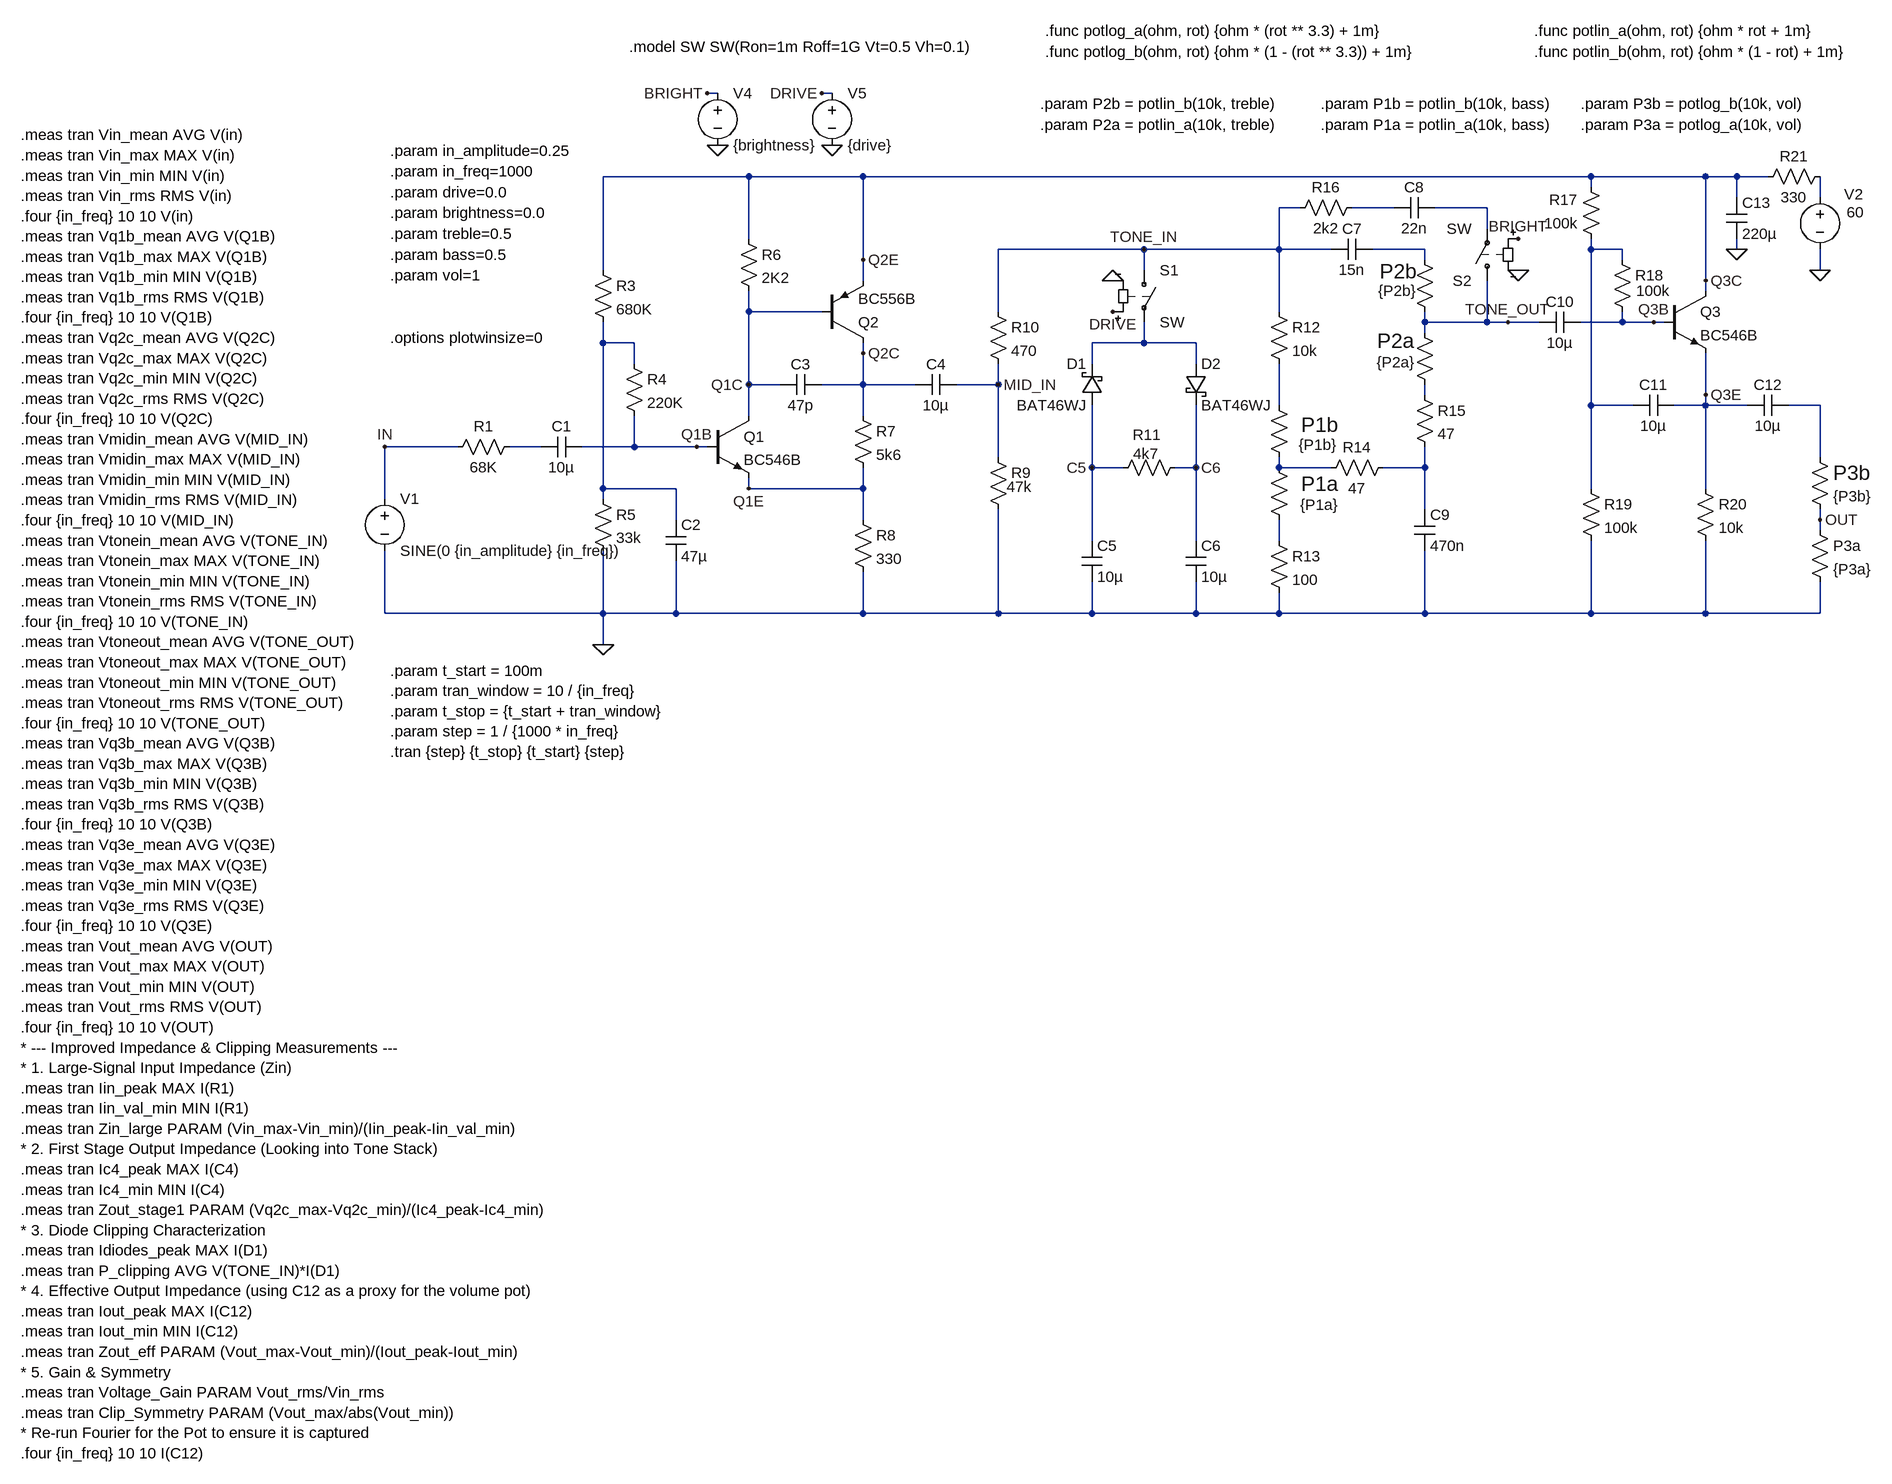
[diagram p0: schematic red_circuits_design.asc]
red_circuits_design.asc, the LTspice schematic file:
Version 4
SHEET 1 2228 1228
WIRE -208 -304 -224 -304
WIRE -32 -304 -48 -304
WIRE -160 -176 -384 -176
WIRE 16 -176 -160 -176
WIRE 1136 -176 16 -176
WIRE 1312 -176 1136 -176
WIRE 1360 -176 1312 -176
WIRE 1408 -176 1360 -176
WIRE 1136 -160 1136 -176
WIRE 1360 -144 1360 -176
WIRE 1488 -144 1488 -176
WIRE 688 -128 656 -128
WIRE 832 -128 768 -128
WIRE 976 -128 896 -128
WIRE 976 -96 976 -128
WIRE -160 -80 -160 -176
WIRE 448 -64 224 -64
WIRE 656 -64 656 -128
WIRE 656 -64 448 -64
WIRE 736 -64 656 -64
WIRE 880 -64 800 -64
WIRE 1136 -64 1136 -80
WIRE 1184 -64 1136 -64
WIRE 1360 -64 1360 -80
WIRE 16 -48 16 -176
WIRE 880 -48 880 -64
WIRE 1184 -48 1184 -64
WIRE -384 -32 -384 -176
WIRE 448 -32 448 -64
WIRE 1488 -32 1488 -64
WIRE 16 -16 16 -48
WIRE 1312 -16 1312 -176
WIRE 1312 0 1312 -16
WIRE -160 32 -160 0
WIRE -48 32 -160 32
WIRE 224 32 224 -64
WIRE 656 32 656 -64
WIRE 880 48 880 32
WIRE 976 48 976 -16
WIRE 976 48 880 48
WIRE 1008 48 976 48
WIRE 1056 48 1008 48
WIRE 1184 48 1184 32
WIRE 1184 48 1120 48
WIRE 1232 48 1184 48
WIRE 1248 48 1232 48
WIRE 880 64 880 48
WIRE -384 80 -384 48
WIRE -336 80 -384 80
WIRE 448 80 448 48
WIRE 448 80 368 80
WIRE 528 80 448 80
WIRE 16 96 16 80
WIRE -336 112 -336 80
WIRE 368 112 368 80
WIRE 528 112 528 80
WIRE -160 144 -160 32
WIRE -112 144 -160 144
WIRE 16 144 16 96
WIRE 16 144 -48 144
WIRE 96 144 16 144
WIRE 224 144 224 112
WIRE 224 144 160 144
WIRE 880 160 880 144
WIRE 1312 160 1312 96
WIRE 656 176 656 112
WIRE 1136 176 1136 -64
WIRE 1200 176 1136 176
WIRE 1312 176 1312 160
WIRE 1312 176 1264 176
WIRE 1376 176 1312 176
WIRE 1488 176 1440 176
WIRE -160 192 -160 144
WIRE 16 192 16 144
WIRE -608 240 -720 240
WIRE -480 240 -528 240
WIRE -336 240 -336 192
WIRE -336 240 -416 240
WIRE -240 240 -336 240
WIRE -224 240 -240 240
WIRE 224 256 224 144
WIRE 1488 256 1488 176
WIRE 368 272 368 176
WIRE 416 272 368 272
WIRE 528 272 528 176
WIRE 528 272 496 272
WIRE 656 272 656 256
WIRE 736 272 656 272
WIRE 880 272 880 240
WIRE 880 272 816 272
WIRE -384 304 -384 80
WIRE -272 304 -384 304
WIRE -160 304 -160 288
WIRE 16 304 16 272
WIRE 16 304 -160 304
WIRE 1136 304 1136 176
WIRE 1312 304 1312 176
WIRE -720 320 -720 240
WIRE -384 320 -384 304
WIRE 880 336 880 272
WIRE -272 352 -272 304
WIRE 16 352 16 304
WIRE 1488 352 1488 336
WIRE 1488 368 1488 352
WIRE 368 384 368 272
WIRE 528 384 528 272
WIRE 656 384 656 352
WIRE -720 496 -720 400
WIRE -384 496 -384 400
WIRE -384 496 -720 496
WIRE -272 496 -272 416
WIRE -272 496 -384 496
WIRE 16 496 16 432
WIRE 16 496 -272 496
WIRE 224 496 224 336
WIRE 224 496 16 496
WIRE 368 496 368 448
WIRE 368 496 224 496
WIRE 528 496 528 448
WIRE 528 496 368 496
WIRE 656 496 656 464
WIRE 656 496 528 496
WIRE 880 496 880 400
WIRE 880 496 656 496
WIRE 1136 496 1136 384
WIRE 1136 496 880 496
WIRE 1312 496 1312 384
WIRE 1312 496 1136 496
WIRE 1488 496 1488 448
WIRE 1488 496 1312 496
WIRE -384 544 -384 496
FLAG 1488 -32 0
FLAG -240 240 Q1B
FLAG -160 144 Q1C
FLAG -160 304 Q1E
FLAG 16 96 Q2C
FLAG 16 -48 Q2E
FLAG 1232 48 Q3B
FLAG 1312 -16 Q3C
FLAG 1312 160 Q3E
FLAG 1488 352 OUT
FLAG -384 544 0
FLAG 224 144 MID_IN
FLAG 368 272 C5
FLAG 528 272 C6
FLAG -720 240 IN
FLAG 1360 -64 0
FLAG 400 -16 0
FLAG 400 32 DRIVE
FLAG -208 -224 0
FLAG -32 -224 0
FLAG -224 -304 BRIGHT
FLAG -48 -304 DRIVE
FLAG 1008 48 TONE_OUT
FLAG 1024 -32 0
FLAG 1024 -80 BRIGHT
FLAG 448 -64 TONE_IN
DATAFLAG -384 80 "round($*100)/100"
DATAFLAG -336 240 "round($*100)/100"
DATAFLAG 16 144 "round($*100)/100"
DATAFLAG -160 32 "round($*100)/100"
DATAFLAG 1136 -32 "round($*100)/100"
DATAFLAG 1184 48 "round($*100)/100"
DATAFLAG 1312 176 "round($*100)/100"
DATAFLAG -80 304 "round($*100)/100"
DATAFLAG 176 144 "round($*100)/100"
DATAFLAG 528 -176 "round($*100)/100"
SYMBOL npn -224 192 R0
SYMATTR InstName Q1
SYMATTR Value BC546B
SYMBOL npn 1248 0 R0
SYMATTR InstName Q3
SYMATTR Value BC546B
SYMBOL Cap -48 128 R90
WINDOW 0 0 32 VBottom 2
WINDOW 3 32 32 VTop 2
SYMATTR InstName C3
SYMATTR Value 47p
SYMBOL Cap 160 128 R90
WINDOW 0 0 32 VBottom 2
WINDOW 3 32 32 VTop 2
SYMATTR InstName C4
SYMATTR Value 10µ
SYMBOL Res 0 176 R0
SYMATTR InstName R7
SYMATTR Value 5k6
SYMBOL Res -400 -48 R0
SYMATTR InstName R3
SYMATTR Value 680K
SYMBOL Res -176 -96 R0
SYMATTR InstName R6
SYMATTR Value 2K2
SYMBOL Res 208 16 R0
SYMATTR InstName R10
SYMATTR Value 470
SYMBOL Res 0 336 R0
SYMATTR InstName R8
SYMATTR Value 330
SYMBOL Res 640 160 R0
WINDOW 0 50 46 Left 3
WINDOW 3 46 77 Left 2
SYMATTR InstName P1b
SYMATTR Value {P1b}
SYMBOL Res 640 256 R0
WINDOW 0 50 41 Left 3
WINDOW 3 48 73 Left 2
SYMATTR InstName P1a
SYMATTR Value {P1a}
SYMBOL Res 832 256 R90
WINDOW 0 0 56 VBottom 2
WINDOW 3 32 56 VTop 2
SYMATTR InstName R14
SYMATTR Value 47
SYMBOL Cap 800 -80 R90
WINDOW 0 0 32 VBottom 2
WINDOW 3 32 32 VTop 2
SYMATTR InstName C7
SYMATTR Value 15n
SYMBOL Res 864 -64 R0
WINDOW 3 -56 64 Left 2
WINDOW 0 -53 34 Left 3
SYMATTR Value {P2b}
SYMATTR InstName P2b
SYMBOL Res 864 48 R0
WINDOW 3 -58 62 Left 2
WINDOW 0 -57 29 Left 3
SYMATTR Value {P2a}
SYMATTR InstName P2a
SYMBOL Cap 864 336 R0
SYMATTR InstName C9
SYMATTR Value 470n
SYMBOL Cap 1120 32 R90
WINDOW 0 0 32 VBottom 2
WINDOW 3 32 32 VTop 2
SYMATTR InstName C10
SYMATTR Value 10µ
SYMBOL Res 1152 -64 R180
WINDOW 0 36 76 Left 2
WINDOW 3 36 40 Left 2
SYMATTR InstName R17
SYMATTR Value 100k
SYMBOL Res 1296 288 R0
SYMATTR InstName R20
SYMATTR Value 10k
SYMBOL Res -400 304 R0
SYMATTR InstName R5
SYMATTR Value 33k
SYMBOL Res 1120 288 R0
SYMATTR InstName R19
SYMATTR Value 100k
SYMBOL voltage 1488 -160 R0
WINDOW 0 37 11 Left 2
WINDOW 3 41 39 Left 2
SYMATTR InstName V2
SYMATTR Value 60
SYMBOL pnp -48 80 M180
SYMATTR InstName Q2
SYMATTR Value BC556B
SYMBOL Cap 352 384 R0
SYMATTR InstName C5
SYMATTR Value 10µ
SYMBOL Cap 512 384 R0
SYMATTR InstName C6
SYMATTR Value 10µ
SYMBOL Res 512 256 R90
WINDOW 0 -19 59 VBottom 2
WINDOW 3 -21 61 VTop 2
SYMATTR InstName R11
SYMATTR Value 4k7
SYMBOL Res 1472 352 R0
SYMATTR InstName P3a
SYMATTR Value {P3a}
SYMBOL Res 1472 240 R0
WINDOW 0 36 40 Left 3
SYMATTR InstName P3b
SYMATTR Value {P3b}
SYMBOL Cap -288 352 R0
SYMATTR InstName C2
SYMATTR Value 47µ
SYMBOL Res -352 96 R0
SYMATTR InstName R4
SYMATTR Value 220K
SYMBOL Res 640 16 R0
SYMATTR InstName R12
SYMATTR Value 10k
SYMBOL Res 640 368 R0
SYMATTR InstName R13
SYMATTR Value 100
SYMBOL Res 864 144 R0
SYMATTR InstName R15
SYMATTR Value 47
SYMBOL Res 1168 -64 R0
WINDOW 3 37 64 Left 2
SYMATTR Value 100k
SYMATTR InstName R18
SYMBOL Cap 1264 160 R90
WINDOW 0 0 32 VBottom 2
WINDOW 3 32 32 VTop 2
SYMATTR InstName C11
SYMATTR Value 10µ
SYMBOL Cap 1440 160 R90
WINDOW 0 0 32 VBottom 2
WINDOW 3 32 32 VTop 2
SYMATTR InstName C12
SYMATTR Value 10µ
SYMBOL Res 208 240 R0
WINDOW 3 29 61 Left 2
SYMATTR Value 47k
SYMATTR InstName R9
SYMBOL schottky 384 176 R180
WINDOW 0 24 64 Left 2
WINDOW 3 24 0 Left 2
SYMATTR InstName D1
SYMATTR Value BAT46WJ
SYMATTR Description Diode
SYMATTR Type diode
SYMBOL schottky 512 112 R0
SYMATTR InstName D2
SYMATTR Value BAT46WJ
SYMATTR Description Diode
SYMATTR Type diode
SYMBOL Res -512 224 R90
WINDOW 0 0 56 VBottom 2
WINDOW 3 32 56 VTop 2
SYMATTR InstName R1
SYMATTR Value 68K
SYMBOL Cap -416 224 R90
WINDOW 0 0 32 VBottom 2
WINDOW 3 32 32 VTop 2
SYMATTR InstName C1
SYMATTR Value 10µ
SYMBOL Res 784 -144 R90
WINDOW 0 0 56 VBottom 2
WINDOW 3 32 56 VTop 2
SYMATTR InstName R16
SYMATTR Value 2k2
SYMBOL Res 1504 -192 R90
WINDOW 0 0 56 VBottom 2
WINDOW 3 32 56 VTop 2
SYMATTR InstName R21
SYMATTR Value 330
SYMBOL Cap 1344 -144 R0
SYMATTR InstName C13
SYMATTR Value 220µ
SYMBOL sw 448 -48 R0
SYMATTR InstName S1
SYMBOL sw 976 0 R180
SYMATTR InstName S2
SYMBOL Voltage -208 -320 R0
SYMATTR InstName V4
SYMATTR Value {brightness}
SYMBOL Voltage -32 -320 R0
SYMATTR InstName V5
SYMATTR Value {drive}
SYMBOL Cap 896 -144 R90
WINDOW 0 0 32 VBottom 2
WINDOW 3 32 32 VTop 2
SYMATTR InstName C8
SYMATTR Value 22n
SYMBOL Voltage -720 304 R0
SYMATTR InstName V1
SYMATTR Value SINE(0 {in_amplitude} {in_freq})
TEXT -712 -88 Left 2 !.param treble=0.5
TEXT -712 -152 Left 2 !.param drive=0.0
TEXT 296 -400 Left 2 !.func potlog_a(ohm, rot) {ohm * (rot ** 3.3) + 1m}
TEXT 288 -288 Left 2 !.param P2b = potlin_b(10k, treble)
TEXT 288 -256 Left 2 !.param P2a = potlin_a(10k, treble)
TEXT 720 -288 Left 2 !.param P1b = potlin_b(10k, bass)
TEXT 720 -256 Left 2 !.param P1a = potlin_a(10k, bass)
TEXT -712 -56 Left 2 !.param bass=0.5
TEXT 1120 -288 Left 2 !.param P3b = potlog_b(10k, vol)
TEXT 1120 -256 Left 2 !.param P3a = potlog_a(10k, vol)
TEXT -712 -24 Left 2 !.param vol=1
TEXT 296 -368 Left 2 !.func potlog_b(ohm, rot) {ohm * (1 - (rot ** 3.3)) + 1m}
TEXT 1048 -400 Left 2 !.func potlin_a(ohm, rot) {ohm * rot + 1m}
TEXT 1048 -368 Left 2 !.func potlin_b(ohm, rot) {ohm * (1 - rot) + 1m}
TEXT -344 -376 Left 2 !.model SW SW(Ron=1m Roff=1G Vt=0.5 Vh=0.1)
TEXT -712 -120 Left 2 !.param brightness=0.0
TEXT -712 -216 Left 2 !.param in_amplitude=0.25
TEXT -712 -184 Left 2 !.param in_freq=1000
TEXT -712 72 Left 2 !.options plotwinsize=0
TEXT -712 584 Left 2 !.param t_start = 100m\n.param tran_window = 10 / {in_freq}\n.param t_stop = {t_start + tran_window}\n.param step = 1 / {1000 * in_freq}\n.tran {step} {t_stop} {t_start} {step}
TEXT -1280 -240 Left 2 !.meas tran Vin_mean AVG V(in)\n.meas tran Vin_max MAX V(in)\n.meas tran Vin_min MIN V(in)\n.meas tran Vin_rms RMS V(in)\n.four {in_freq} 10 10 V(in)\n.meas tran Vq1b_mean AVG V(Q1B)\n.meas tran Vq1b_max MAX V(Q1B)\n.meas tran Vq1b_min MIN V(Q1B)\n.meas tran Vq1b_rms RMS V(Q1B)\n.four {in_freq} 10 10 V(Q1B)\n.meas tran Vq2c_mean AVG V(Q2C)\n.meas tran Vq2c_max MAX V(Q2C)\n.meas tran Vq2c_min MIN V(Q2C)\n.meas tran Vq2c_rms RMS V(Q2C)\n.four {in_freq} 10 10 V(Q2C)\n.meas tran Vmidin_mean AVG V(MID_IN)\n.meas tran Vmidin_max MAX V(MID_IN)\n.meas tran Vmidin_min MIN V(MID_IN)\n.meas tran Vmidin_rms RMS V(MID_IN)\n.four {in_freq} 10 10 V(MID_IN)\n.meas tran Vtonein_mean AVG V(TONE_IN)\n.meas tran Vtonein_max MAX V(TONE_IN)\n.meas tran Vtonein_min MIN V(TONE_IN)\n.meas tran Vtonein_rms RMS V(TONE_IN)\n.four {in_freq} 10 10 V(TONE_IN)\n.meas tran Vtoneout_mean AVG V(TONE_OUT)\n.meas tran Vtoneout_max MAX V(TONE_OUT)\n.meas tran Vtoneout_min MIN V(TONE_OUT)\n.meas tran Vtoneout_rms RMS V(TONE_OUT)\n.four {in_freq} 10 10 V(TONE_OUT)\n.meas tran Vq3b_mean AVG V(Q3B)\n.meas tran Vq3b_max MAX V(Q3B)\n.meas tran Vq3b_min MIN V(Q3B)\n.meas tran Vq3b_rms RMS V(Q3B)\n.four {in_freq} 10 10 V(Q3B)\n.meas tran Vq3e_mean AVG V(Q3E)\n.meas tran Vq3e_max MAX V(Q3E)\n.meas tran Vq3e_min MIN V(Q3E)\n.meas tran Vq3e_rms RMS V(Q3E)\n.four {in_freq} 10 10 V(Q3E)\n.meas tran Vout_mean AVG V(OUT)\n.meas tran Vout_max MAX V(OUT)\n.meas tran Vout_min MIN V(OUT)\n.meas tran Vout_rms RMS V(OUT)\n.four {in_freq} 10 10 V(OUT)\n* --- Improved Impedance & Clipping Measurements ---\n* 1. Large-Signal Input Impedance (Zin)\n.meas tran Iin_peak MAX I(R1)\n.meas tran Iin_val_min MIN I(R1)\n.meas tran Zin_large PARAM (Vin_max-Vin_min)/(Iin_peak-Iin_val_min)\n* 2. First Stage Output Impedance (Looking into Tone Stack)\n.meas tran Ic4_peak MAX I(C4)\n.meas tran Ic4_min MIN I(C4)\n.meas tran Zout_stage1 PARAM (Vq2c_max-Vq2c_min)/(Ic4_peak-Ic4_min)\n* 3. Diode Clipping Characterization\n.meas tran Idiodes_peak MAX I(D1)\n.meas tran P_clipping AVG V(TONE_IN)*I(D1)\n* 4. Effective Output Impedance (using C12 as a proxy for the volume pot)\n.meas tran Iout_peak MAX I(C12)\n.meas tran Iout_min MIN I(C12)\n.meas tran Zout_eff PARAM (Vout_max-Vout_min)/(Iout_peak-Iout_min)\n* 5. Gain & Symmetry\n.meas tran Voltage_Gain PARAM Vout_rms/Vin_rms\n.meas tran Clip_Symmetry PARAM (Vout_max/abs(Vout_min))\n* Re-run Fourier for the Pot to ensure it is captured\n.four {in_freq} 10 10 I(C12)

The netlist it stands for:
* red_circuits_design.asc
Q1 Q1C Q1B Q1E 0 BC546B
Q3 Q3C Q3B Q3E 0 BC546B
C3 Q2C Q1C 47p
C4 MID_IN Q2C 10µ
R7 Q2C Q1E 5k6
R3 Q3C N006 680K
R6 Q3C Q1C 2K2
R10 TONE_IN MID_IN 470
R8 Q1E 0 330
R§P1b N009 N012 {P1b}
R§P1a N012 N014 {P1a}
R14 N013 N012 47
C7 N004 TONE_IN 15n
R§P2b N004 TONE_OUT {P2b}
R§P2a TONE_OUT N008 {P2a}
C9 N013 0 470n
C10 Q3B TONE_OUT 10µ
R17 N005 Q3C 100k
R20 Q3E 0 10k
R5 N006 0 33k
R19 N005 0 100k
V2 N001 0 60
Q2 Q2C Q1C Q3C 0 BC556B
C5 C5 0 10µ
C6 C6 0 10µ
R11 C6 C5 4k7
R§P3a OUT 0 {P3a}
R§P3b N010 OUT {P3b}
C2 N006 0 47µ
R4 N006 Q1B 220K
R12 TONE_IN N009 10k
R13 N014 0 100
R15 N008 N013 47
R18 N005 Q3B 100k
C11 Q3E N005 10µ
C12 N010 Q3E 10µ
R9 MID_IN 0 47k
D1 C5 N007 BAT46WJ
D2 N007 C6 BAT46WJ
R1 N011 IN 68K
C1 Q1B N011 10µ
R16 N002 TONE_IN 2k2
R21 N001 Q3C 330
C13 Q3C 0 220µ
S1 TONE_IN N007 DRIVE 0 SW
S2 TONE_OUT N003 BRIGHT 0 SW
V4 BRIGHT 0 {brightness}
V5 DRIVE 0 {drive}
C8 N003 N002 22n
V1 IN 0 SINE(0 {in_amplitude} {in_freq})
.model D D
.lib standard.dio
.model NPN NPN
.model PNP PNP
.lib standard.bjt
.param treble=0.5
.param drive=0.0
.func potlog_a(ohm, rot) {ohm * (rot ** 3.3) + 1m}
.param P2b = potlin_b(10k, treble)
.param P2a = potlin_a(10k, treble)
.param P1b = potlin_b(10k, bass)
.param P1a = potlin_a(10k, bass)
.param bass=0.5
.param P3b = potlog_b(10k, vol)
.param P3a = potlog_a(10k, vol)
.param vol=1
.func potlog_b(ohm, rot) {ohm * (1 - (rot ** 3.3)) + 1m}
.func potlin_a(ohm, rot) {ohm * rot + 1m}
.func potlin_b(ohm, rot) {ohm * (1 - rot) + 1m}
.model SW SW(Ron=1m Roff=1G Vt=0.5 Vh=0.1)
.param brightness=0.0
.param in_amplitude=0.25
.param in_freq=1000
.options plotwinsize=0
.param t_start = 100m
.param tran_window = 10 / {in_freq}
.param t_stop = {t_start + tran_window}
.param step = 1 / {1000 * in_freq}
.tran {step} {t_stop} {t_start} {step}
.meas tran Vin_mean AVG V(in)
.meas tran Vin_max MAX V(in)
.meas tran Vin_min MIN V(in)
.meas tran Vin_rms RMS V(in)
.four {in_freq} 10 10 V(in)
.meas tran Vq1b_mean AVG V(Q1B)
.meas tran Vq1b_max MAX V(Q1B)
.meas tran Vq1b_min MIN V(Q1B)
.meas tran Vq1b_rms RMS V(Q1B)
.four {in_freq} 10 10 V(Q1B)
.meas tran Vq2c_mean AVG V(Q2C)
.meas tran Vq2c_max MAX V(Q2C)
.meas tran Vq2c_min MIN V(Q2C)
.meas tran Vq2c_rms RMS V(Q2C)
.four {in_freq} 10 10 V(Q2C)
.meas tran Vmidin_mean AVG V(MID_IN)
.meas tran Vmidin_max MAX V(MID_IN)
.meas tran Vmidin_min MIN V(MID_IN)
.meas tran Vmidin_rms RMS V(MID_IN)
.four {in_freq} 10 10 V(MID_IN)
.meas tran Vtonein_mean AVG V(TONE_IN)
.meas tran Vtonein_max MAX V(TONE_IN)
.meas tran Vtonein_min MIN V(TONE_IN)
.meas tran Vtonein_rms RMS V(TONE_IN)
.four {in_freq} 10 10 V(TONE_IN)
.meas tran Vtoneout_mean AVG V(TONE_OUT)
.meas tran Vtoneout_max MAX V(TONE_OUT)
.meas tran Vtoneout_min MIN V(TONE_OUT)
.meas tran Vtoneout_rms RMS V(TONE_OUT)
.four {in_freq} 10 10 V(TONE_OUT)
.meas tran Vq3b_mean AVG V(Q3B)
.meas tran Vq3b_max MAX V(Q3B)
.meas tran Vq3b_min MIN V(Q3B)
.meas tran Vq3b_rms RMS V(Q3B)
.four {in_freq} 10 10 V(Q3B)
.meas tran Vq3e_mean AVG V(Q3E)
.meas tran Vq3e_max MAX V(Q3E)
.meas tran Vq3e_min MIN V(Q3E)
.meas tran Vq3e_rms RMS V(Q3E)
.four {in_freq} 10 10 V(Q3E)
.meas tran Vout_mean AVG V(OUT)
.meas tran Vout_max MAX V(OUT)
.meas tran Vout_min MIN V(OUT)
.meas tran Vout_rms RMS V(OUT)
.four {in_freq} 10 10 V(OUT)
* --- Improved Impedance & Clipping Measurements ---
* 1. Large-Signal Input Impedance (Zin)
.meas tran Iin_peak MAX I(R1)
.meas tran Iin_val_min MIN I(R1)
.meas tran Zin_large PARAM (Vin_max-Vin_min)/(Iin_peak-Iin_val_min)
* 2. First Stage Output Impedance (Looking into Tone Stack)
.meas tran Ic4_peak MAX I(C4)
.meas tran Ic4_min MIN I(C4)
.meas tran Zout_stage1 PARAM (Vq2c_max-Vq2c_min)/(Ic4_peak-Ic4_min)
* 3. Diode Clipping Characterization
.meas tran Idiodes_peak MAX I(D1)
.meas tran P_clipping AVG V(TONE_IN)*I(D1)
* 4. Effective Output Impedance (using C12 as a proxy for the volume pot)
.meas tran Iout_peak MAX I(C12)
.meas tran Iout_min MIN I(C12)
.meas tran Zout_eff PARAM (Vout_max-Vout_min)/(Iout_peak-Iout_min)
* 5. Gain & Symmetry
.meas tran Voltage_Gain PARAM Vout_rms/Vin_rms
.meas tran Clip_Symmetry PARAM (Vout_max/abs(Vout_min))
* Re-run Fourier for the Pot to ensure it is captured
.four {in_freq} 10 10 I(C12)
.backanno
.end